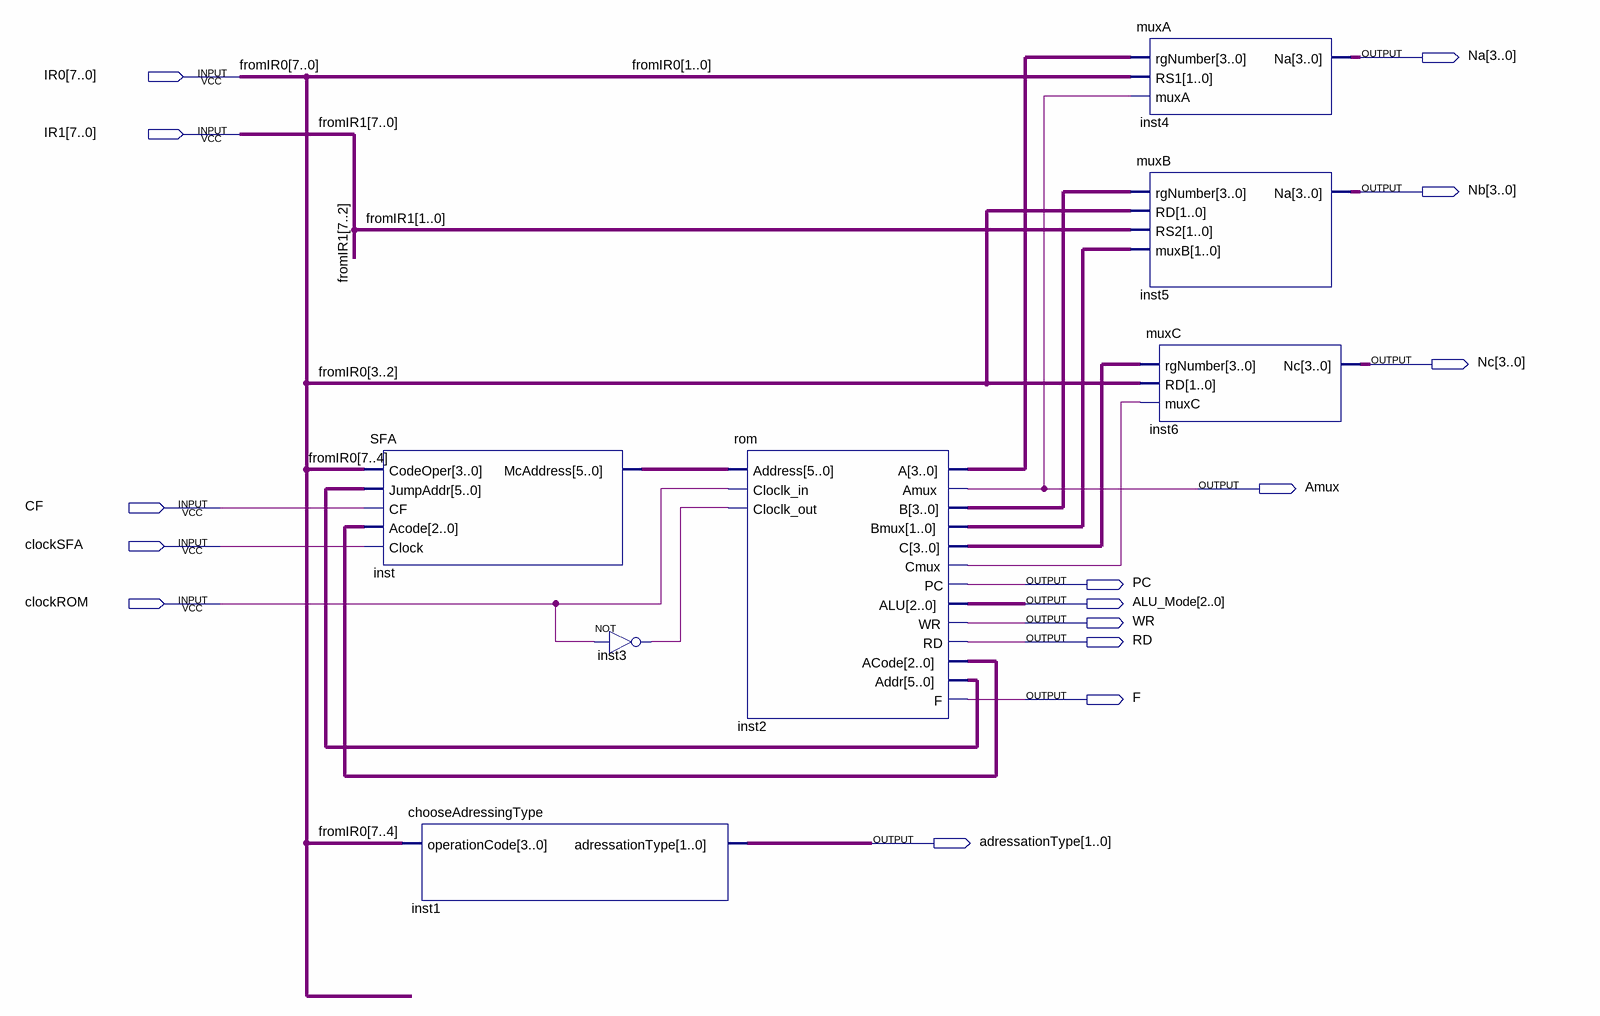
[diagram p0: schematic sheet]
// Quartus schematic ControlUnit.bdf as structural Verilog: 7 symbols, 15 pins
module ControlUnit (
  input  [7:0] IR0,
  input  [7:0] IR1,
  input  CF,
  input  clockSFA,
  input  clockROM,
  output [3:0] Na,
  output [3:0] Nb,
  output [3:0] Nc,
  output Amux,
  output PC,
  output [2:0] ALU_Mode,
  output WR,
  output RD,
  output F,
  output [1:0] adressationType
);

  wire inst2_cmux, inst3_out;
  wire [1:0] inst2_bmux;
  wire [2:0] inst2_acode;
  wire [3:0] inst2_a, inst2_b, inst2_c;
  wire [5:0] inst2_addr, inst_mcaddress;

  SFA inst (
    .CodeOper(IR0[7:4]), .JumpAddr(inst2_addr), .CF(CF), .Acode(inst2_acode), .Clock(clockSFA),
    .McAddress(inst_mcaddress));
  chooseAdressingType inst1 (.operationCode(IR0[7:4]), .adressationType(adressationType));
  not inst3 (inst3_out, clockROM);
  rom inst2 (
    .Address(inst_mcaddress), .Cloclk_in(clockROM), .Cloclk_out(inst3_out), .A(inst2_a), .Amux(Amux),
    .B(inst2_b), .Bmux(inst2_bmux), .C(inst2_c), .Cmux(inst2_cmux), .PC(PC), .ALU(ALU_Mode), .WR(WR),
    .RD(RD), .ACode(inst2_acode), .Addr(inst2_addr), .F(F));
  muxA inst4 (.rgNumber(inst2_a), .RS1(IR0[1:0]), .muxA(Amux), .Na(Na));
  muxB inst5 (.rgNumber(inst2_b), .RD(IR0[3:2]), .RS2(IR1[1:0]), .muxB(inst2_bmux), .Na(Nb));
  muxC inst6 (.rgNumber(inst2_c), .RD(IR0[3:2]), .muxC(inst2_cmux), .Nc(Nc));

  // Other names for the same wires on the sheet: fromIR0[7:0] = IR0; fromIR1[7:0] = IR1
endmodule
